# Altium schematic sheet Power_Supply_1.SchDoc
size A4
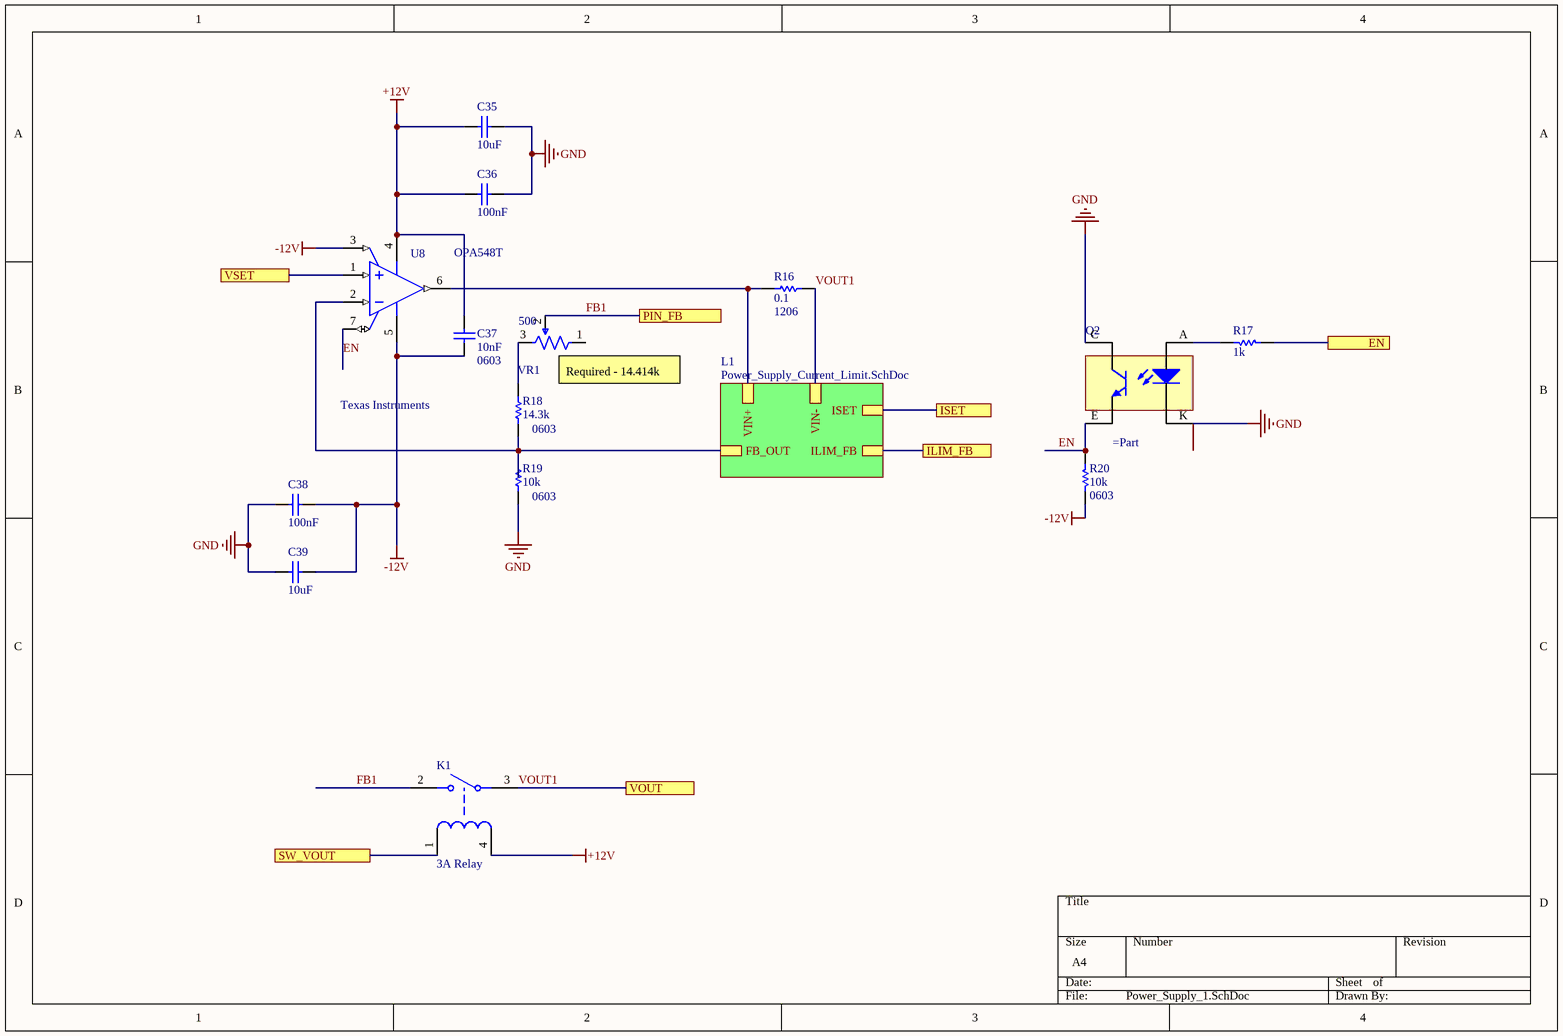
[diagram p0: Power_Supply_1.SchDoc]

## Parts
C35  10uF  [CAPC3216X127X50ML20T25]
C36  100nF  [CAPC1608X09N]
C37  10nF  Package / Case: 0603  [CAPC1608X09N]
C38  100nF  [CAPC1608X09N]
C39  10uF  [CAPC3216X127X50ML20T25]
K1  3A Relay  [PCB-ei6nokn2irsc2a7yt94x-1]
Q2  (no value)  [PCB-tryrgihdrozpg2dv6q87-1]
R16  0.1  Package / Case: 1206  [RESC3116X07M]
R17  1k  [gen0603-2]
R18  14.3k  Package / Case: 0603  [gen0603-2]
R19  10k  Package / Case: 0603  [gen0603-2]
R20  10k  Package / Case: 0603  [gen0603-2]
U8  OPA548T  Manufacturer: Texas Instruments  [TI-KVT7]
VR1  500  [PCB-8uuv2uwn1geg2g5qqyha-1]

## Sub-sheets
L1 = Power_Supply_Current_Limit.SchDoc: VIN-, FB_OUT, VIN+, ILIM_FB, ISET

## Ports
EN, ILIM_FB, ISET, PIN_FB, SW_VOUT, VOUT, VSET

## Nets
+12V: C35.2 C36.2 C37.2 K1.4 U8.4(V-)
-12V: C37.1 C38.2 C39.2 R20.1 U8.3(ILIM) U8.5(V+)
GND: C35.1 C36.1 C38.1 C39.1 Q2.C Q2.K R19.1
EN: Q2.E R20.2 U8.7(E/S)
EN: R17.2 ; port EN  [a separate net that carries the same name]
FB1: K1.2 VR1.2(CW) ; port PIN_FB
ILIM_FB: port ILIM_FB, sheet L1/ILIM_FB
ISET: port ISET, sheet L1/ISET
SW_VOUT: K1.1 ; port SW_VOUT
VOUT1: K1.3 R16.1 ; port VOUT, sheet L1/VIN-
VSET: U8.1(VIN+) ; port VSET
NetQ2_A: Q2.A R17.1
NetR16_2: R16.2 U8.6(VO) ; sheet L1/VIN+
NetR18_1: R18.1 R19.2 U8.2(VIN-) ; sheet L1/FB_OUT
NetR18_2: R18.2 VR1.3(CW)

Not connected (* = marked no-connect by the designer): VR1 1(CCW)

## Notes on the sheet
- (near VR1) Required - 14.414k

## Library data of the parts
C35 C39 = CMP-126371-4: CAP CER 0.1UF 100V 10% X7R 1206; Manufacturer: Samsung Electro-Mechanics; Manufacture Part Number: CL31B106KBHNNNE; Voltage-Rated: 50V; Supplier: LCSC; Capacitance: 10uF; Package / Case: 1206; Capacitance Tolerance: 10%; Supplier Part Number: C89632
C36 C38 = CMP-2f55e5122ad9f092-5: 0603 10 nF 50 V ± 10% Tolerance X7R Surface Mount Multilayer Ceramic Capacitor; Manufacture Part Number: CC0603KRX7R9BB104; Manufacturer: YAGEO; Voltage-Rated: 50V; Capacitance Tolerance: 10%; Capacitance: 100nF; Package / Case: 0603; Supplier: LCSC; Supplier Part Number: C14663
C37 = CMP-2f55e5122ad9f092-5: 0603 10 nF 50 V ± 10% Tolerance X7R Surface Mount Multilayer Ceramic Capacitor; Manufacture Part Number: CL10B103KC8NNNC; Manufacturer: Samsung Electro-Mechanics; Voltage-Rated: 100V; Capacitance Tolerance: 10%; Capacitance: 10nF; Supplier: LCSC; Supplier Part Number: C84709
K1 = CMP-edc624afa9603201-3: Power Relay 12VDC 3DC/5AAC SPST-NO( (20.5mm 7.2mm 15.3mm)) THT; Manufacturer: Omron Electronics; Manufacture Part Number: G5NB-1A-E-DC12; Supplier: LCSC; Supplier Part Number: C225714; Current-Rated: 3A
Q2 = CMP-20cdecc1b9d8ff0a-1: Optocoupler DC-IN 1-CH Transistor DC-OUT 4-Pin PDIP SMD Black Box; Manufacturer: TOSHIBA; Manufacture Part Number: TLP785(GB-TP6,F(C; Supplier: LCSC; Supplier Part Number: C45445
R16 = CMP-90ca5a8d69034f0d-5: Res Thick Film 3.2 x 1.6 mm 10K Ohm 1% 0.25W(1/4W) 100ppm/ C Molded SMD Paper T/R; Manufacture Part Number: 1206W4F100LT5E; Manufacturer: UNI-ROYAL(Uniroyal Elec); Resistance: 0.1; Resistance Tolerance: 1%; Supplier: LCSC; Supplier Part Number: C25334
R17 = CMP-1853278-27_13: Surface Mount Thick Film Resistor, RC Series, 1 kohm, 100 mW, - 1%, 50 V, 0603 [1608 Metric]; Manufacturer: YAGEO; Manufacture Part Number: RC0603FR-071KL; Resistance Tolerance: 1%; Supplier: LCSC; Supplier Part Number: C22548; Resistance: 1k; Package / Case: 0603
R18 = CMP-1853278-27: Surface Mount Thick Film Resistor, RC Series, 1 kohm, 100 mW, - 1%, 50 V, 0603 [1608 Metric]; Manufacturer: UNI-ROYAL(Uniroyal Elec); Manufacture Part Number: 0603WAF1432T5E; Resistance Tolerance: 1%; Supplier: LCSC; Supplier Part Number: C22799; Resistance: 14.3k
R19 R20 = CMP-1853278-27: Surface Mount Thick Film Resistor, RC Series, 1 kohm, 100 mW, - 1%, 50 V, 0603 [1608 Metric]; Manufacturer: YAGEO; Manufacture Part Number: RC0603FR-0710KL; Resistance Tolerance: 1%; Supplier: LCSC; Supplier Part Number: C98220; Resistance: 10k
U8 = CMP-13615009-4: High-Voltage, High-Current Operational Amplifier, Excellent Output Swing, 8 to 60 V, -40 to 85 degC, 7-pin FM (KVT7), Green (RoHS & no Sb/Br); Bandwidth: 1000000.0 Hz; Input Offset Drift: 3e-05 V/K; Lead-Free Status: Lead Free; Number of Channels: 1; Slew Rate: 10.0 V/μs; Supply Voltage (DC): 60.0 V; Gain Bandwidth Product: 1000000.0 Hz; Lifecycle Status: Active; Mounting Style: Through Hole; Number of Circuits: 1; Number of Pins: 7; Octopart Url: https://octopart.com/opa548t-texas+instruments-420784; OctopartID: 076ece6249b8d8a9; Packaging: Bulk; REACH SVHC Compliance: No SVHC; RoHS: Compliant; Manufacture Part Number: OPA548T; Supplier Part Number: C138712; Supplier: LCSC
VR1 = CMP-7537bc3cde65aaf0-3: Trimmer; Cermet; Rest 500 Ohms; PCB; 25 Turns; Pwr-Rtg 0.5W; Manufacture Part Number: 3296W-1-501; Manufacturer: BOCHEN(Chengdu Guosheng Tech); Voltage Rating (DC) 300v: 300 V; Temperature Coefficient: -100 ppm/°C to 100 ppm/°C; Supplier: LCSC; Supplier Part Number: C118913; Resistance: 500